# Altium project LIA.PrjPcb
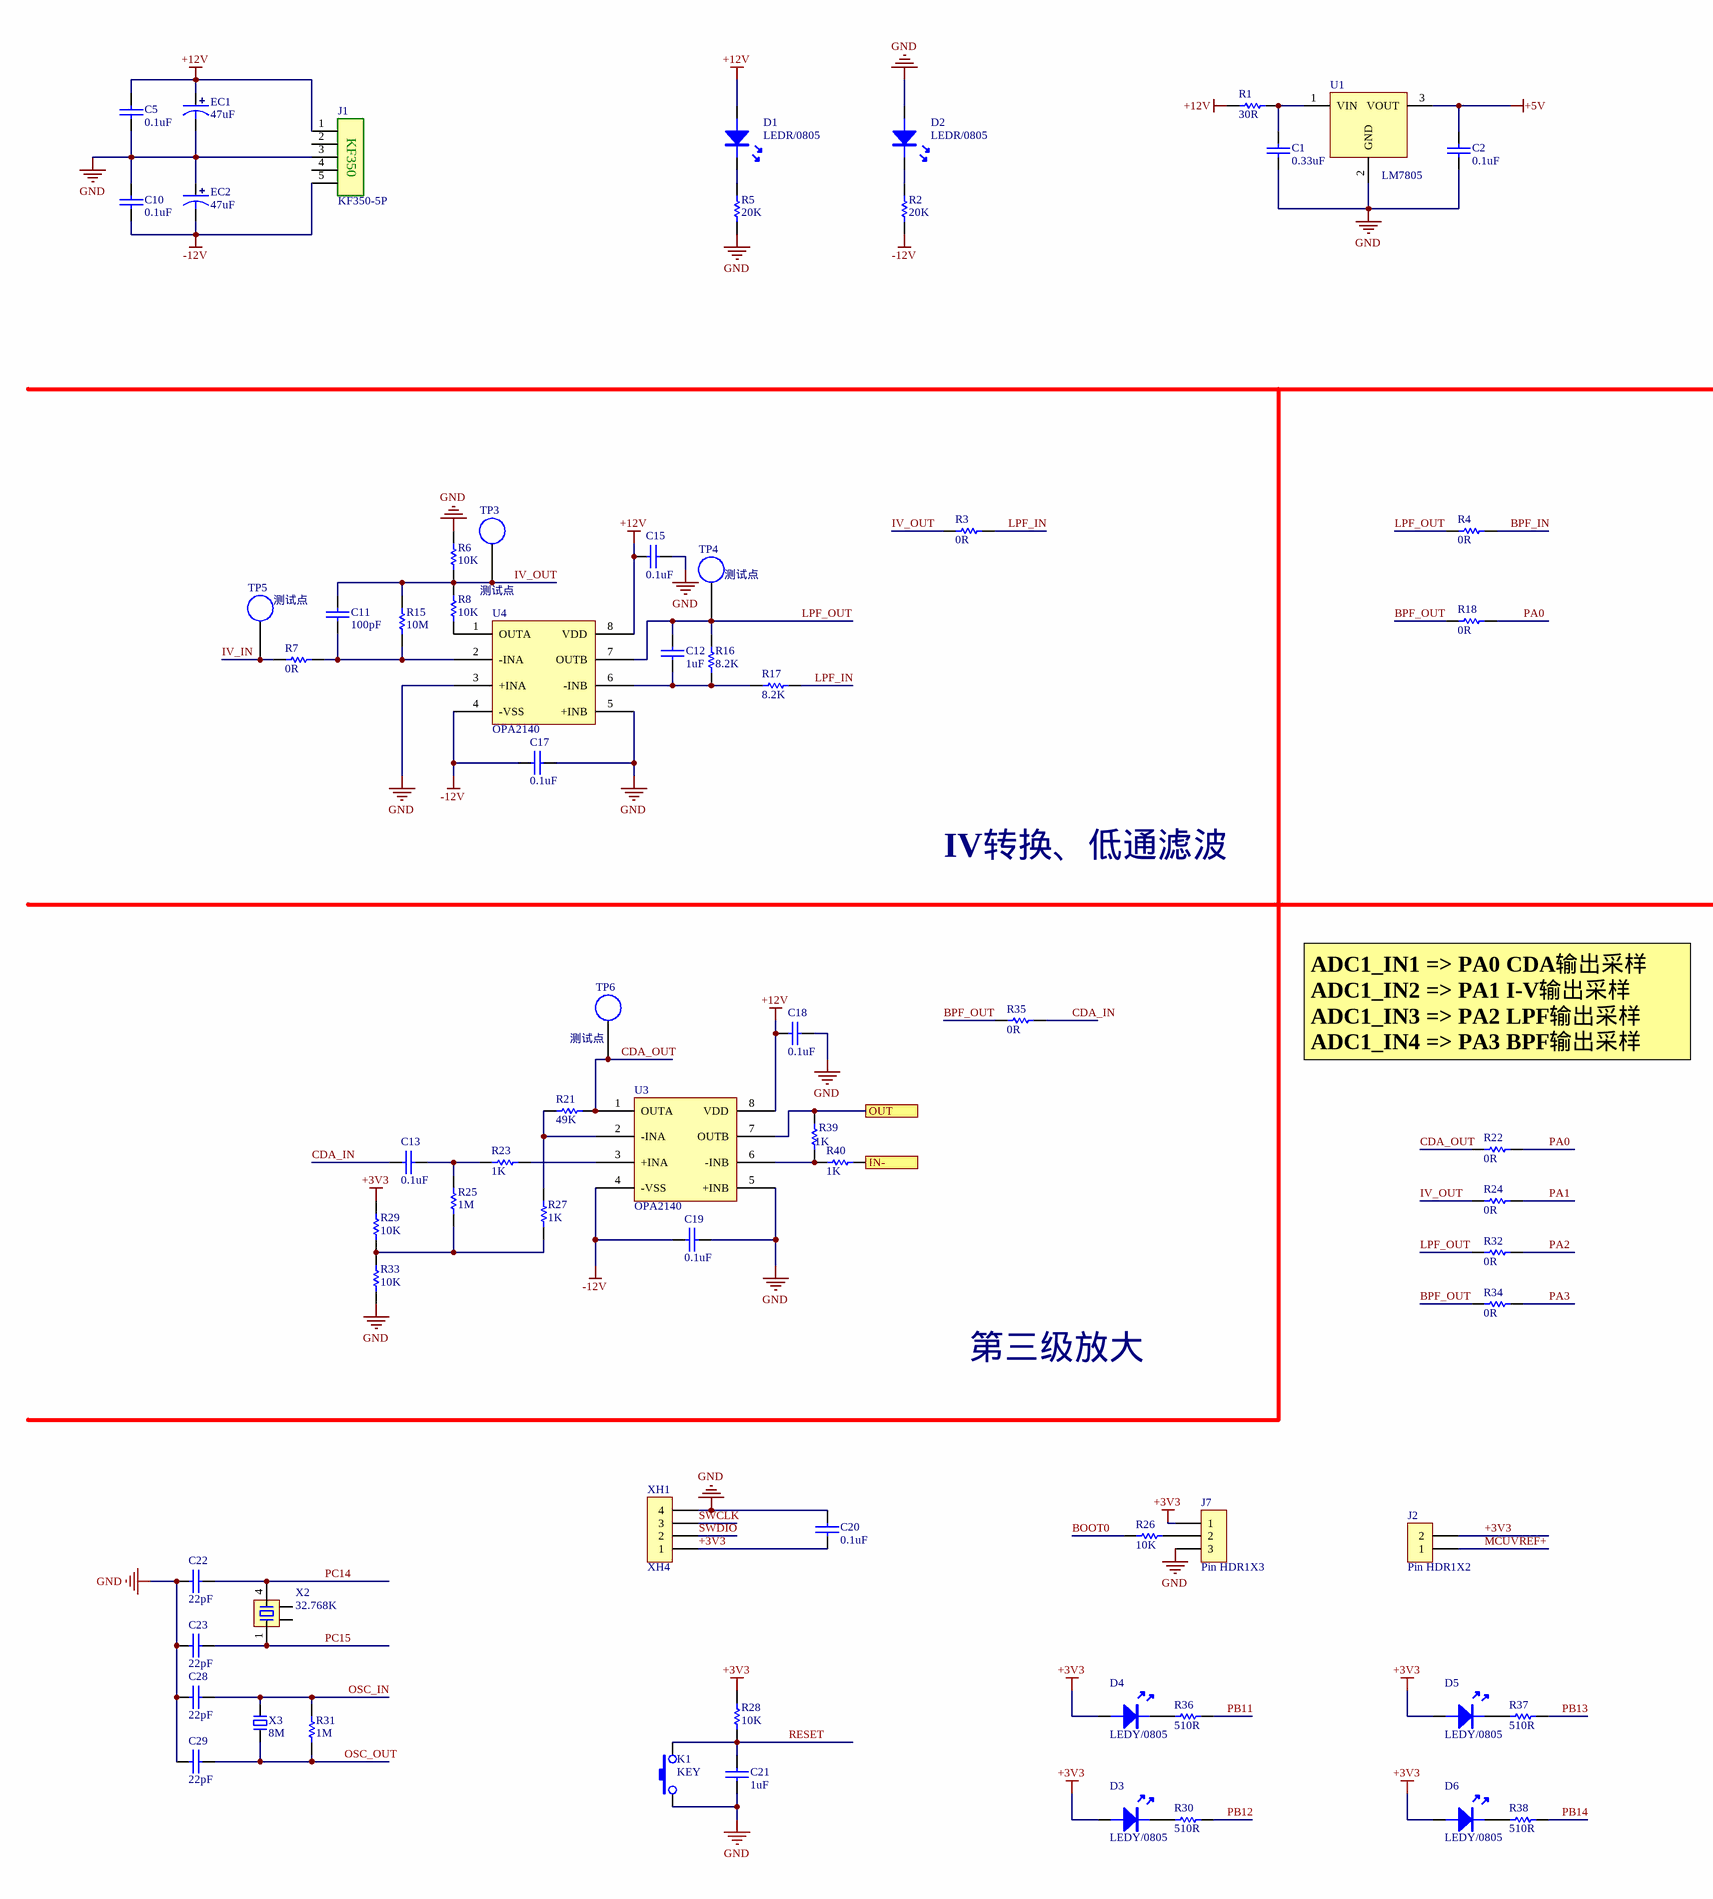
[diagram p0: LIA.SchDoc, left]
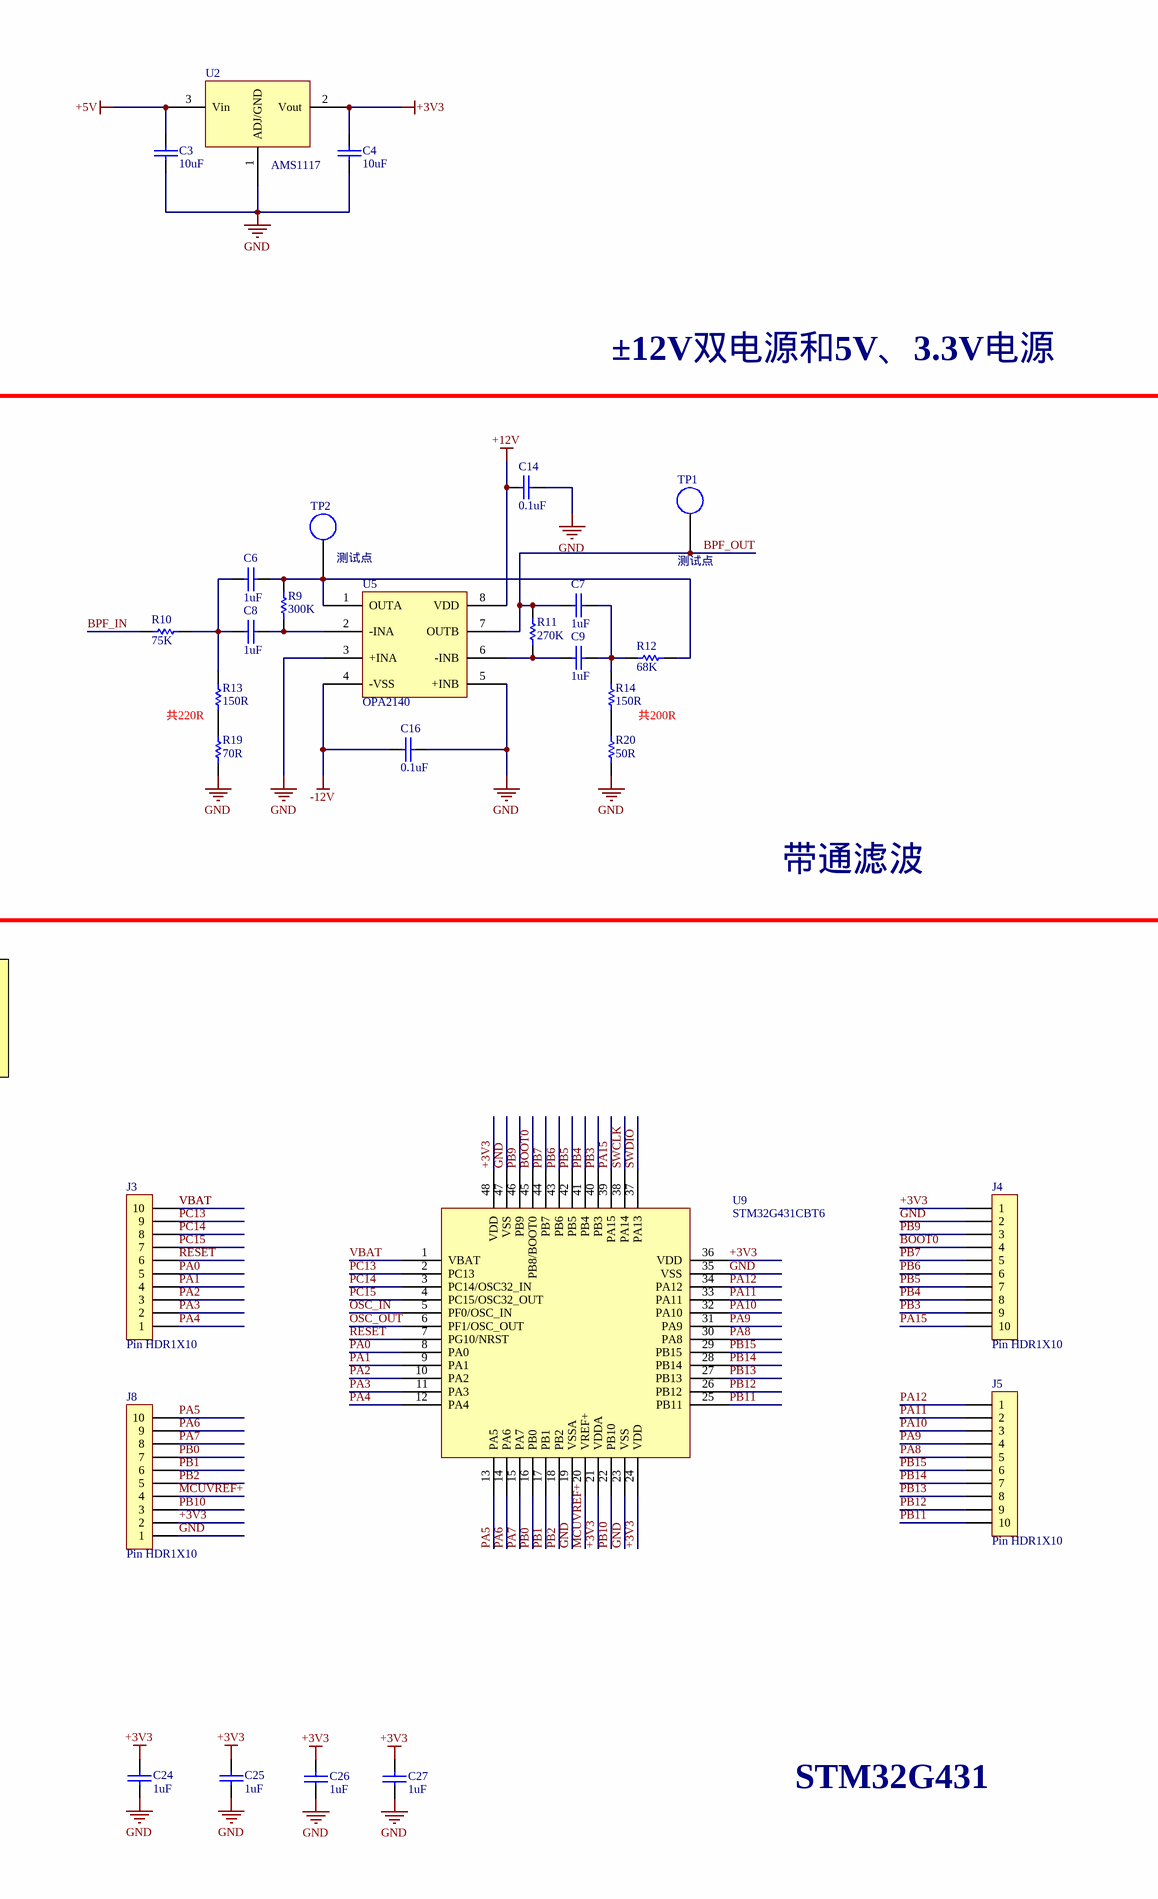
[diagram p1: LIA.SchDoc, right]
1 sheet, 100 parts. Net scope: flat (ports and power ports of the same name join across sheets).
Board file: LIA.PcbDoc

## Sheet LIA.SchDoc
size A2

### Parts
C1  0.33uF  [0603C]
C2  0.1uF  [0603C]
C3  10uF  [0603C]
C4  10uF  [0603C]
C5  0.1uF  [0603C]
C6  1uF  [DIP-7]
C7  1uF  [DIP-7]
C8  1uF  [DIP-7]
C9  1uF  [DIP-7]
C10  0.1uF  [0603C]
C11  100pF  [0603C]
C12  1uF  [0603C]
C13  0.1uF  [0603C]
C14  0.1uF  [0603C]
C15  0.1uF  [0603C]
C16  0.1uF  [0603C]
C17  0.1uF  [0603C]
C18  0.1uF  [0603C]
C19  0.1uF  [0603C]
C20  0.1uF  [0603C]
C21  1uF  [0603C]
C22  22pF  [0603C]
C23  22pF  [0603C]
C24  1uF  [0603C]
C25  1uF  [0603C]
C26  1uF  [0603C]
C27  1uF  [0603C]
C28  22pF  [0603C]
C29  22pF  [0603C]
D1  LEDR/0805  [LED-0805R]
D2  LEDR/0805  [LED-0805R]
D3  LEDY/0805  [LED-0805Y]
D4  LEDY/0805  [LED-0805Y]
D5  LEDY/0805  [LED-0805Y]
D6  LEDY/0805  [LED-0805Y]
EC1  47uF  [SMD-EC5.0X5.3X5.4]
EC2  47uF  [SMD-EC5.0X5.3X5.4]
J1  KF350-5P  [KF350-5P]
J2  Pin HDR1X2  [Pin HDR1X2/2.54mm-S]
J3  Pin HDR1X10  [Pin HDR1X10/2.54mm-S]
J4  Pin HDR1X10  [Pin HDR1X10/2.54mm-S]
J5  Pin HDR1X10  [Pin HDR1X10/2.54mm-S]
J7  Pin HDR1X3  [Pin HDR1X3/2.54mm-S]
J8  Pin HDR1X10  [Pin HDR1X10/2.54mm-S]
K1  KEY  [SMD-3X6X2.5]
R1  30R  [0603R]
R2  20K  [0603R]
R3  0R  [0603R]
R4  0R  [0603R]
R5  20K  [0603R]
R6  10K  [0603R]
R7  0R  [0603R]
R8  10K  [0603R]
R9  300K  [0603R]
R10  75K  [0603R]
R11  270K  [0603R]
R12  68K  [0603R]
R13  150R  [0603R]
R14  150R  [0603R]
R15  10M  [0603R]
R16  8.2K  [0603R]
R17  8.2K  [0603R]
R18  0R  [0603R]
R19  70R  [0603R]
R20  50R  [0603R]
R21  49K  [0603R]
R22  0R  [0603R]
R23  1K  [0603R]
R24  0R  [0603R]
R25  1M  [0603R]
R26  10K  [0603R]
R27  1K  [0603R]
R28  10K  [0603R]
R29  10K  [0603R]
R30  510R  [0603R]
R31  1M  [0603R]
R32  0R  [0603R]
R33  10K  [0603R]
R34  0R  [0603R]
R35  0R  [0603R]
R36  510R  [0603R]
R37  510R  [0603R]
R38  510R  [0603R]
R39  1K  [0603R]
R40  1K  [0603R]
TP1  测试点  [TP]
TP2  测试点  [TP]
TP3  测试点  [TP]
TP4  测试点  [TP]
TP5  测试点  [TP]
TP6  测试点  [TP]
U1  LM7805  [TO252]
U2  AMS1117  [SOT223]
U3  OPA2140  [SOP8]
U4  OPA2140  [SOP8]
U5  OPA2140  [SOP8]
U9  STM32G431CBT6  [LQFP48 7X7]
X2  32.768K  [OSC MC-306]
X3  8M  [OSC HC-49S]
XH1  XH4  [XH4/2.54mm/180]

### Ports
IN-, OUT

### Nets
+3V3: C4.2 C20.1 C24.2 C25.2 C26.2 C27.2 D3.A D4.A D5.A D6.A J2.2 J4.1 J7.1 J8.2 R28.1 R29.2 U2.2(Vout) U9.21(VDDA) U9.24(VDD) U9.36(VDD) U9.48(VDD) XH1.1
+5V: C2.2 C3.2 U1.3(VOUT) U2.3(Vin)
+12V: C5.2 C14.1 C15.1 C18.1 D1.A EC1.1 J1.1 R1.1 U3.8(VDD) U4.8(VDD) U5.8(VDD)
-12V: C10.1 C16.1 C17.1 C19.1 EC2.2 J1.5 R2.2 U3.4(-VSS) U4.4(-VSS) U5.4(-VSS)
GND: C1.1 C2.1 C3.1 C4.1 C5.1 C10.2 C14.2 C15.2 C16.2 C17.2 C18.2 C19.2 C20.2 C21.1 C22.2 C23.2 C24.1 C25.1 C26.1 C27.1 C28.2 C29.2 D2.A EC1.2 EC2.1 J1.3 J4.2 J7.3 J8.1 K1.1 R5.2 R6.2 R19.2 R20.2 R33.1 U1.2(GND) U2.1(ADJ/GND) U3.5(+INB) U4.3(+INA) U4.5(+INB) U5.3(+INA) U5.5(+INB) U9.19(VSSA) U9.23(VSS) U9.35(VSS) U9.47(VSS) XH1.4
BOOT0: J4.4 R26.1 U9.45(PB8/BOOT0)
BPF_IN: R4.2 R10.2
BPF_OUT: C7.2 R11.2 R18.1 R34.1 R35.1 TP1.1(TP) U5.7(OUTB)
CDA_IN: C13.1 R35.2
CDA_OUT: R21.2 R22.1 TP6.1(TP) U3.1(OUTA)
IV_IN: R7.2 TP5.1(TP)
IV_OUT: C11.1 R3.1 R6.1 R8.2 R15.2 R24.1 TP3.1(TP)
LPF_IN: R3.2 R17.1
LPF_OUT: C12.1 R4.1 R16.1 R32.1 TP4.1(TP) U4.7(OUTB)
MCUVREF+: J2.1 J8.4 U9.20(VREF+)
OSC_IN: C28.1 R31.2 U9.5(PF0/OSC_IN) X3.2
OSC_OUT: C29.1 R31.1 U9.6(PF1/OSC_OUT) X3.1
PA0: J3.5 R18.2 R22.2 U9.8(PA0)
PA1: J3.4 R24.2 U9.9(PA1)
PA2: J3.3 R32.2 U9.10(PA2)
PA3: J3.2 R34.2 U9.11(PA3)
PA4: J3.1 U9.12(PA4)
PA5: J8.10 U9.13(PA5)
PA6: J8.9 U9.14(PA6)
PA7: J8.8 U9.15(PA7)
PA8: J5.5 U9.30(PA8)
PA9: J5.4 U9.31(PA9)
PA10: J5.3 U9.32(PA10)
PA11: J5.2 U9.33(PA11)
PA12: J5.1 U9.34(PA12)
PA15: J4.10 U9.39(PA15)
PB0: J8.7 U9.16(PB0)
PB1: J8.6 U9.17(PB1)
PB2: J8.5 U9.18(PB2)
PB3: J4.9 U9.40(PB3)
PB4: J4.8 U9.41(PB4)
PB5: J4.7 U9.42(PB5)
PB6: J4.6 U9.43(PB6)
PB7: J4.5 U9.44(PB7)
PB9: J4.3 U9.46(PB9)
PB10: J8.3 U9.22(PB10)
PB11: J5.10 R36.2 U9.25(PB11)
PB12: J5.9 R30.2 U9.26(PB12)
PB13: J5.8 R37.2 U9.27(PB13)
PB14: J5.7 R38.2 U9.28(PB14)
PB15: J5.6 U9.29(PB15)
PC13: J3.9 U9.2(PC13)
PC14: C22.1 J3.8 U9.3(PC14/OSC32_IN) X2.4
PC15: C23.1 J3.7 U9.4(PC15/OSC32_OUT) X2.1
RESET: C21.2 J3.6 K1.3 R28.2 U9.7(PG10/NRST)
SWCLK: U9.38(PA14) XH1.3
SWDIO: U9.37(PA13) XH1.2
VBAT: J3.10 U9.1(VBAT)
NetC1_2: C1.2 R1.2 U1.1(VIN)
NetC6_1: C6.1 R9.2 R12.1 TP2.1(TP) U5.1(OUTA)
NetC6_2: C6.2 C8.1 R10.1 R13.1
NetC7_1: C7.1 C9.2 R12.2 R14.1
NetC8_2: C8.2 R9.1 U5.2(-INA)
NetC9_1: C9.1 R11.1 U5.6(-INB)
NetC11_2: C11.2 R7.1 R15.1 U4.2(-INA)
NetC12_2: C12.2 R16.2 R17.2 U4.6(-INB)
NetC13_2: C13.2 R23.1 R25.1
NetD1_K: D1.K R5.1
NetD2_K: D2.K R2.1
NetD3_K: D3.K R30.1
NetD4_K: D4.K R36.1
NetD5_K: D5.K R37.1
NetD6_K: D6.K R38.1
NetJ7_2: J7.2 R26.2
NetR8_1: R8.1 U4.1(OUTA)
NetR13_2: R13.2 R19.1
NetR14_2: R14.2 R20.1
NetR21_1: R21.1 R27.1 U3.2(-INA)
NetR23_2: R23.2 U3.3(+INA)
NetR25_2: R25.2 R27.2 R29.1 R33.2
NetR39_1: R39.1 R40.2 U3.6(-INB)
NetR39_2: R39.2 U3.7(OUTB) ; port OUT
NetR40_1: R40.1 ; port IN-

Not connected (* = marked no-connect by the designer): J1 2 4; X2 2 3

### Notes on the sheet
- ±12V双电源和5V、3.3V电源
- 共220R
- 共200R
- IV转换、低通滤波
- 带通滤波
- ADC1_IN1 => PA0 CDA输出采样
  ADC1_IN2 => PA1 I-V输出采样
  ADC1_IN3 => PA2 LPF输出采样
  ADC1_IN4 => PA3 BPF输出采样
- 第三级放大
- STM32G431
- (in symbol KF350-5P) KF350

### Library data of the parts
C1-C29 = CAP: 无极性电容
D1-D6 = LED
EC1 EC2 = SMD_ECAP: 贴片电解电容
R1-R40 = RES
U2 = AMS1117: 三端稳压芯片
U3-U5 = NE5532
X2 = XTAL-MC-4P: MC系列4脚晶振
X3 = XTAL-2P: 2脚无源脚晶振